# EAGLE design lokalizator_płytka_uniwersalna (EAGLE 8.5.2)
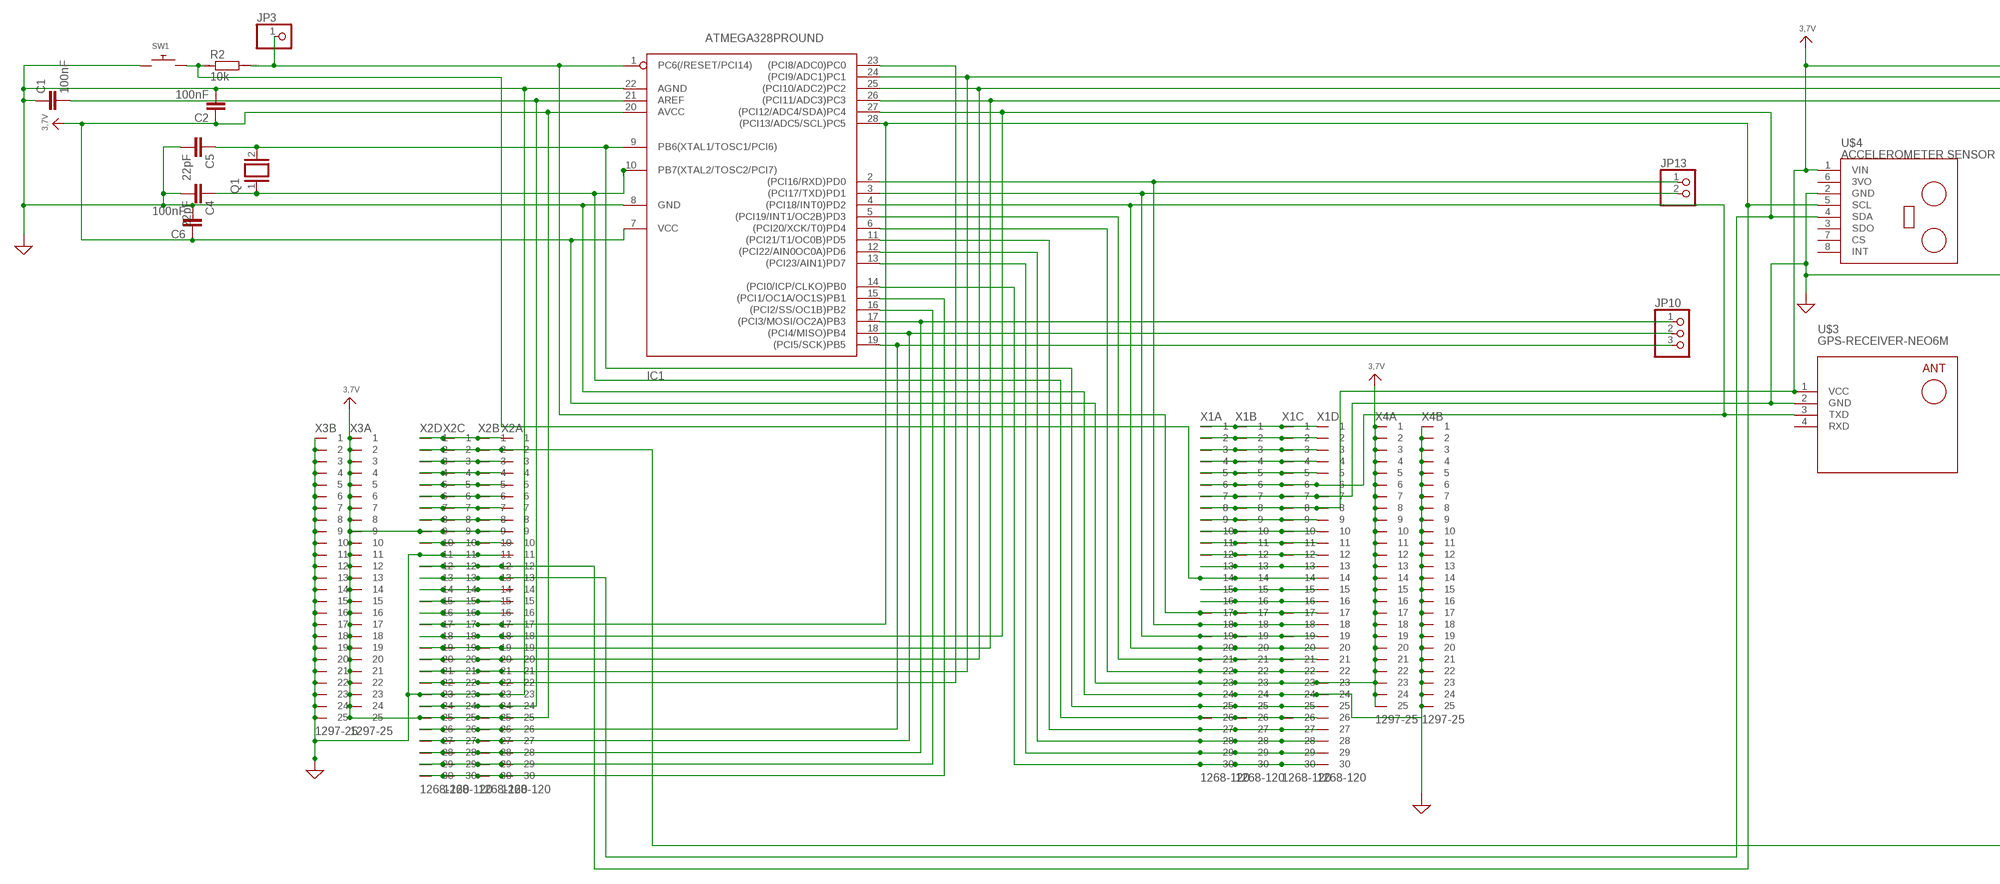
[diagram p0: schematic, sheet 1, part 1 of 2]
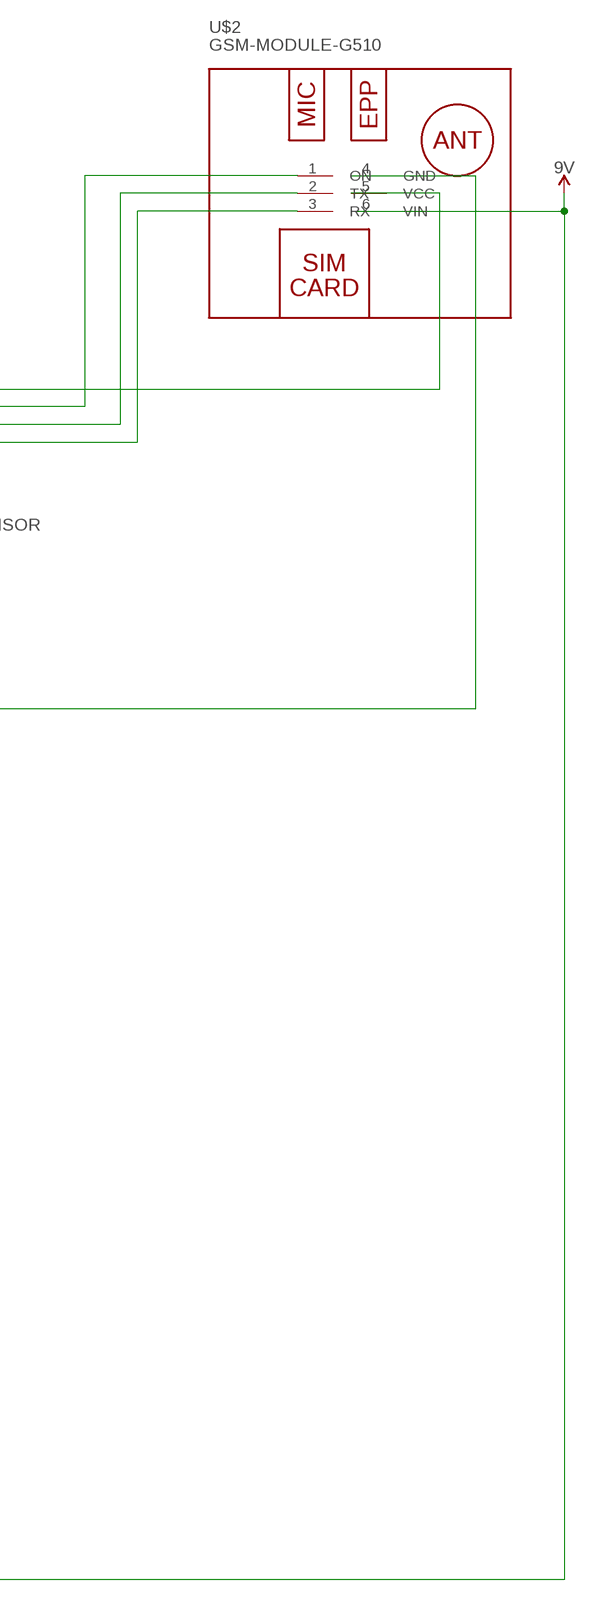
[diagram p1: schematic, sheet 1, part 2 of 2]

## Parts
C1  100nF  C2,5-3  [C2.5-3]
C2  100nF  C2,5-3  [C2.5-3]
C4  22pF  C2,5-3  [C2.5-3]
C5  22pF  C2,5-3  [C2.5-3]
C6  100nF  C2,5-3  [C2.5-3]
IC1  ATMEGA328PROUND  [DIL28-3-ROUND]
JP3  PINHD-1X1  [1X01]
JP10  PINHD-1X3  [1X03]
JP13  PINHD-1X2  [1X02]
Q1  XTAL  [Q]
R2  10k  R0204/7  [0204/7]
SW1  SWITCH_PUSHBUTTONEVQ-PE  [TACT_PANA-EVQ]
U$2  GSM-MODULE-G510  GSM-MODEM-SIM900A  [GSM-MODEM-SIM900A]
U$3  GPS-RECEIVER-NEO6M  [GPS-RECEIVER-NEO6M]
U$4  ACCELEROMETER SENSOR  LIGHT-SENSOR-BH1750  [LIGHT-SENSOR-BH1750]
X1  1268-120  [1268-120]
X2  1268-120  [1268-120]
X3  1297-25  [1297-25]
X4  1297-25  [1297-25]

## Nets
GND: C1.1 C2.2 C4.2 C5.2 C6.2 IC1.8(GND) IC1.22(AGND) SW1.P$1 U$2.4(GND) U$3.2(GND) U$4.2(GND) X1.A7 X1.A24 X1.B7 X1.B24 X1.C7 X1.C24 X1.D7 X1.D24 X2.A11 X2.A23 X2.B11 X2.B23 X2.C11 X2.C23 X2.D11 X2.D23 X3.B1 X3.B2 X3.B3 X3.B4 X3.B5 X3.B6 X3.B7 X3.B8 X3.B9 X3.B10 X3.B11 X3.B12 X3.B13 X3.B14 X3.B15 X3.B16 X3.B17 X3.B18 X3.B19 X3.B20 X3.B21 X3.B22 X3.B23 X3.B24 X3.B25 X4.B1 X4.B2 X4.B3 X4.B4 X4.B5 X4.B6 X4.B7 X4.B8 X4.B9 X4.B10 X4.B11 X4.B12 X4.B13 X4.B14 X4.B15 X4.B16 X4.B17 X4.B18 X4.B19 X4.B20 X4.B21 X4.B22 X4.B23 X4.B24 X4.B25 ; supply symbol labelled SUP
N$1: R2.1 SW1.P$2 X1.A14 X1.B14 X1.C14 X1.D14
N$2: IC1.1(PC6(/RESET/PCI14)) JP3.1 R2.2 X1.A17 X1.B17 X1.C17 X1.D17
N$3: C1.2 IC1.21(AREF) X2.A24 X2.B24 X2.C24 X2.D24
N$5: IC1.19((PCI5/SCK)PB5) JP10.3 X2.A26 X2.B26 X2.C26 X2.D26
N$6: C5.1 IC1.9(PB6(XTAL1/TOSC1/PCI6)) Q1.2 X1.A25 X1.B25 X1.C25 X1.D25
N$7: C4.1 IC1.10(PB7(XTAL2/TOSC2/PCI7)) Q1.1 X1.A26 X1.B26 X1.C26 X1.D26
N$8: IC1.18((PCI4/MISO)PB4) JP10.2 X2.A27 X2.B27 X2.C27 X2.D27
N$9: IC1.17((PCI3/MOSI/OC2A)PB3) JP10.1 X2.A28 X2.B28 X2.C28 X2.D28
N$10: IC1.14((PCI0/ICP/CLKO)PB0) X1.A30 X1.B30 X1.C30 X1.D30
N$11: IC1.28((PCI13/ADC5/SCL)PC5) U$4.5(SCL) X2.A12 X2.A17 X2.B12 X2.B17 X2.C12 X2.C17 X2.D12 X2.D17
N$12: X1.A16 X1.B16 X1.C16 X1.D16
N$13: IC1.4((PCI18/INT0)PD2) U$3.3(TXD) X1.A6 X1.A20 X1.B6 X1.B20 X1.C6 X1.C20 X1.D6 X1.D20
N$14: IC1.24((PCI9/ADC1)PC1) U$2.1(ON) X2.A21 X2.B21 X2.C21 X2.D21
N$15: IC1.2((PCI16/RXD)PD0) JP13.1 X1.A18 X1.B18 X1.C18 X1.D18
N$16: IC1.3((PCI17/TXD)PD1) JP13.2 X1.A19 X1.B19 X1.C19 X1.D19
N$17: IC1.25((PCI10/ADC2)PC2) U$2.2(TX) X2.A20 X2.B20 X2.C20 X2.D20
N$18: IC1.26((PCI11/ADC3)PC3) U$2.3(RX) X2.A19 X2.B19 X2.C19 X2.D19
N$19: IC1.15((PCI1/OC1A/OC1S)PB1) X2.A30 X2.B30 X2.C30 X2.D30
N$20: IC1.16((PCI2/SS/OC1B)PB2) X2.A29 X2.B29 X2.C29 X2.D29
N$21: IC1.13((PCI23/AIN1)PD7) X1.A29 X1.B29 X1.C29 X1.D29
N$22: IC1.12((PCI22/AIN0OC0A)PD6) X1.A28 X1.B28 X1.C28 X1.D28
N$23: IC1.11((PCI21/T1/OC0B)PD5) X1.A27 X1.B27 X1.C27 X1.D27
N$24: IC1.23((PCI8/ADC0)PC0) X2.A22 X2.B22 X2.C22 X2.D22
N$25: IC1.5((PCI19/INT1/OC2B)PD3) X1.A21 X1.B21 X1.C21 X1.D21
N$26: IC1.27((PCI12/ADC4/SDA)PC4) U$4.4(SDA) X2.A13 X2.A18 X2.B13 X2.B18 X2.C13 X2.C18 X2.D13 X2.D18
N$27: IC1.6((PCI20/XCK/T0)PD4) X1.A22 X1.B22 X1.C22 X1.D22
N$28: X1.A15 X1.B15 X1.C15 X1.D15
N$29: X1.A13 X1.B13 X1.C13 X1.D13
N$30: X1.A12 X1.B12 X1.C12 X1.D12
N$31: X1.A11 X1.B11 X1.C11 X1.D11
N$32: X1.A10 X1.B10 X1.C10 X1.D10
N$33: X1.A9 X1.B9 X1.C9 X1.D9
N$37: X1.A5 X1.B5 X1.C5 X1.D5
N$38: X1.A4 X1.B4 X1.C4 X1.D4
N$39: X1.A3 X1.B3 X1.C3 X1.D3
N$40: X1.A2 X1.B2 X1.C2 X1.D2
N$41: X1.A1 X1.B1 X1.C1 X1.D1
N$42: X2.A16 X2.B16 X2.C16 X2.D16
N$43: X2.A15 X2.B15 X2.C15 X2.D15
N$44: X2.A14 X2.B14 X2.C14 X2.D14
N$48: X2.A10 X2.B10 X2.C10 X2.D10
N$50: X2.A8 X2.B8 X2.C8 X2.D8
N$51: X2.A7 X2.B7 X2.C7 X2.D7
N$52: X2.A6 X2.B6 X2.C6 X2.D6
N$53: X2.A5 X2.B5 X2.C5 X2.D5
N$54: X2.A4 X2.B4 X2.C4 X2.D4
N$55: X2.A3 X2.B3 X2.C3 X2.D3
N$57: X2.A1 X2.B1 X2.C1 X2.D1
VCC: C2.1 C6.1 IC1.7(VCC) IC1.20(AVCC) U$2.5(VCC) U$2.6(VIN) U$3.1(VCC) U$4.1(VIN) X1.A8 X1.A23 X1.B8 X1.B23 X1.C8 X1.C23 X1.D8 X1.D23 X2.A2 X2.A9 X2.A25 X2.B2 X2.B9 X2.B25 X2.C2 X2.C9 X2.C25 X2.D2 X2.D9 X2.D25 X3.A1 X3.A2 X3.A3 X3.A4 X3.A5 X3.A6 X3.A7 X3.A8 X3.A9 X3.A10 X3.A11 X3.A12 X3.A13 X3.A14 X3.A15 X3.A16 X3.A17 X3.A18 X3.A19 X3.A20 X3.A21 X3.A22 X3.A23 X3.A24 X3.A25 X4.A1 X4.A2 X4.A3 X4.A4 X4.A5 X4.A6 X4.A7 X4.A8 X4.A9 X4.A10 X4.A11 X4.A12 X4.A13 X4.A14 X4.A15 X4.A16 X4.A17 X4.A18 X4.A19 X4.A20 X4.A21 X4.A22 X4.A23 X4.A24 X4.A25 ; supply symbol labelled 3,7V, 9V
Unconnected: U$4.3(SDO) U$4.7(CS) U$4.8(INT)

## Power pins joined to a net without a drawn wire
3VO: U$4.6(3VO)
RXD: U$3.4(RXD)

## Library data of the parts
C1 C2 C4-C6 = capacitor-wima:C: CAPACITOR naming: grid - package width
IC1 = atmega328:ATMEGA328*P: MICROCONTROLLER 32 kBytes FLASH 2 kBytes SRAM 1 kBytes EEPROM USART 8-channel 10 bit ADC
JP3 = adafruit:PINHD-1X1: Pin header 1x1 for 0.1" spacing With round pins
JP10 = adafruit:PINHD-1X3: PIN HEADER
JP13 = pinhead:PINHD-1X2: PIN HEADER
Q1 = special:XTAL: CRYSTAL
R2 = eagle-ltspice:R: RESISTOR, European symbol; SPICEMODEL: NONE; SPICEPREFIX: R
SW1 = adafruit:SWITCH_PUSHBUTTON: Buttons SOFTTOUCHSMD_SJ - Soft touch temporary push button (Super Junk Akihabara) Compatible with SKPMANE010 [Mouser: 688-SKPMAN] C&K_KSS = Digikey: KSS221GLFS
U$2 = diy-modules2:GSM-MODEM-SIM900A: GSM Mini Module based on SIM900A Schematic available here: http://www.electrodragon.com/w/SIM900_(SIM900A)_Mini_DEV_Board
U$3 = diy-modules2:GPS-RECEIVER-NEO6M: GPS Receiver Module based on NEO-6 device Short tutorial how to use NEO-6 module with Arduino: http://www.xarg.org/2016/06/neo6mv2-gps-module-with-arduino/ NEO-6 datasheet is available here: https://www.u-blox.com/sites/default/files/products/documents/NEO-6_DataSheet_%28GPS.G6-HW-09005%29.pdf Click here to find device on ebay.com <http://www.ebay.com/sch/gyneo6mv2>
U$4 = diy-modules2:LIGHT-SENSOR-BH1750: Digital Light Sensor based on BH1750
X1 X2 = con-commcon:1268-120: .800" BOARD SPACE 2mm CONNECTORS - HI TEMP FOUR ROW 2mm - STACKTHROUGH & NON-STACKTHROUGH; OC_FARNELL: unknown; OC_NEWARK: unknown
X3 X4 = con-commcon:1297-25: .800" BOARD SPACE 2mm CONNECTORS - HI TEMP TWO ROW 2mm - NON-STACKTHROUGH; OC_FARNELL: unknown; OC_NEWARK: unknown

## Module 123
Ports: 

### Library data of the parts

## Board
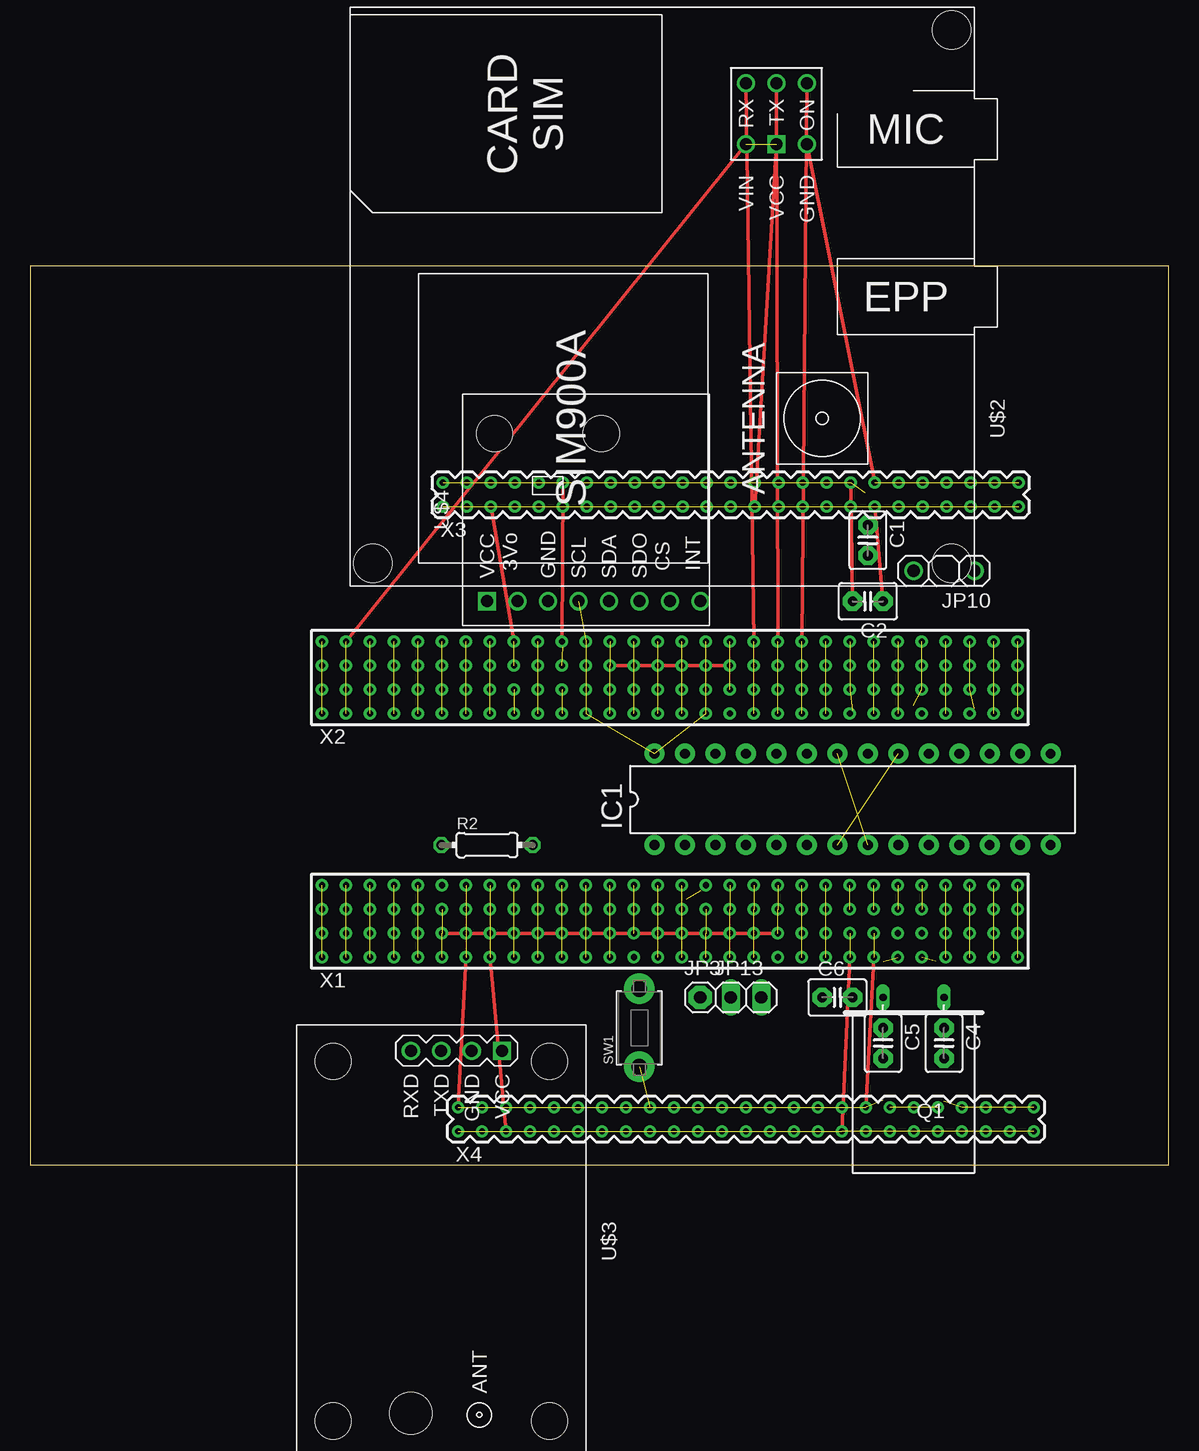
[diagram p2: board, top side]
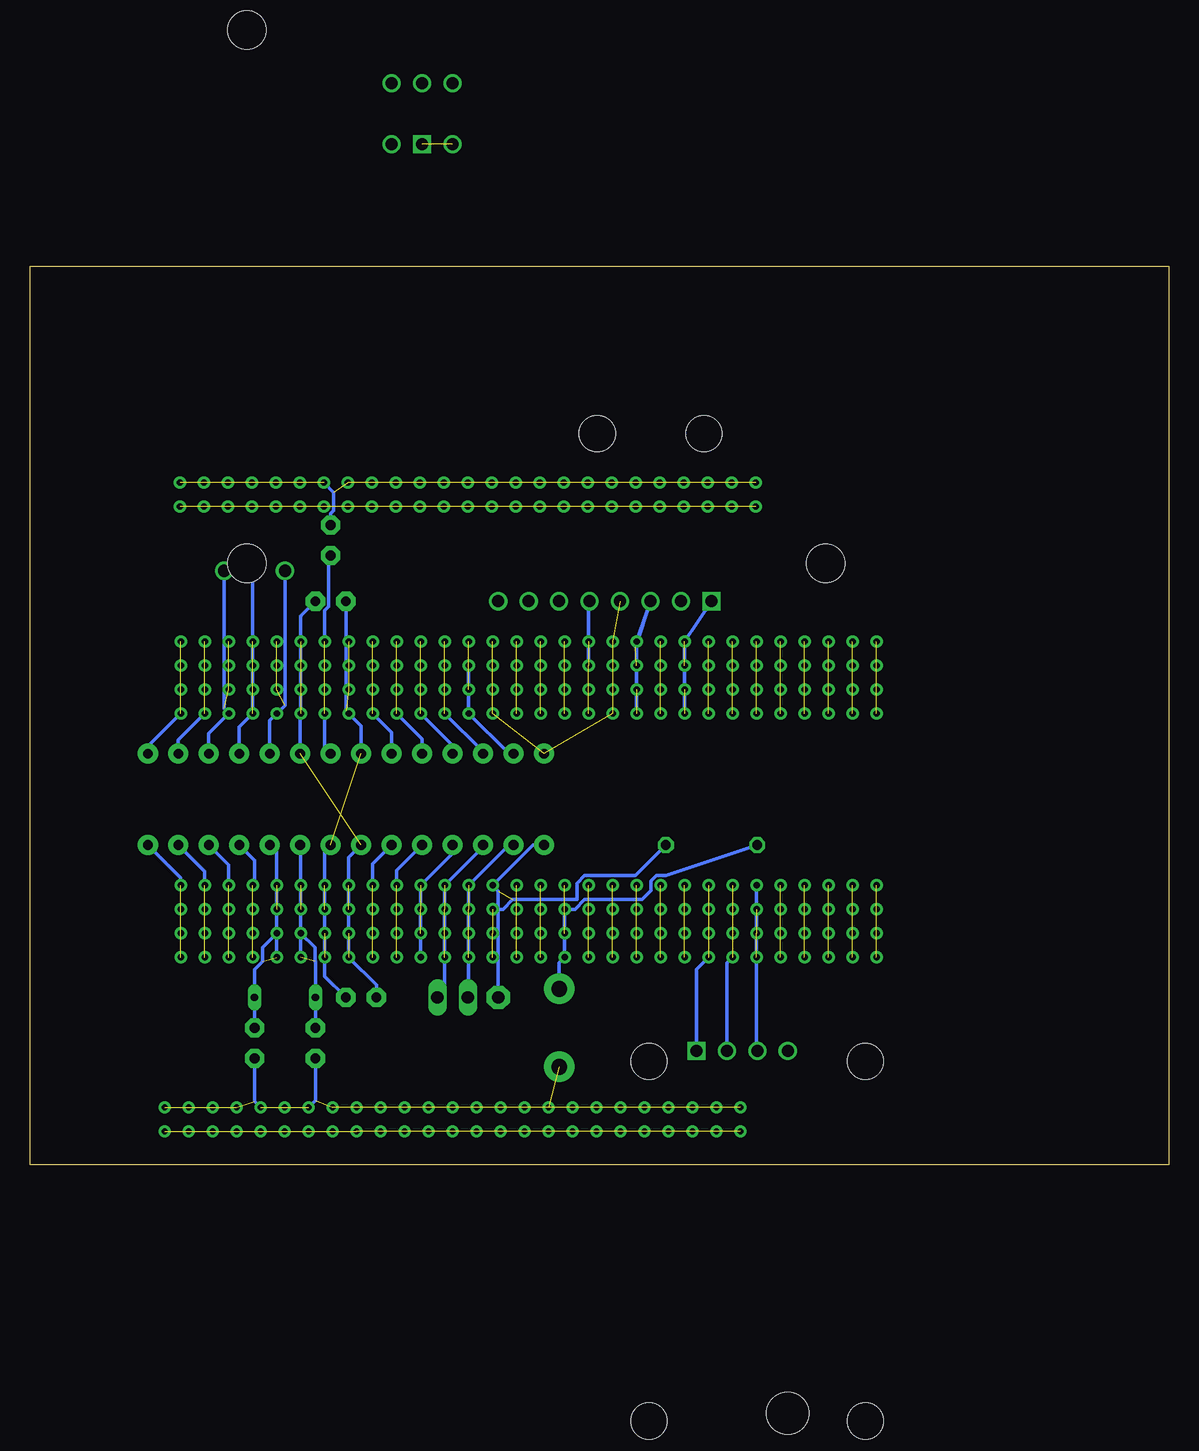
[diagram p3: board, bottom side, seen from below]

Size 94.92 x 74.92 mm. Coordinates in mm from the lower left corner, seen from the top.
Outline: 0,0 94.92,0 94.92,74.92 0,74.92 0,0
Copper layers (1*16): Top 0.035mm / dielectric 1.5mm / Bottom 0.035mm
Design rules "default": minimum track width 6mil, minimum drill 0.35mm, track to track 6mil, track to pad 6mil, pad to pad 6mil, via to via 6mil, smd to smd 6mil, copper to edge 40mil, drill to drill 6mil, minimum pad ring 10mil, minimum via ring 8mil, stop-mask expansion 4mil, vias tented up to drill 0mil, thermal gap 10mil

### Footprints (pad centres in the part's own frame; a part is rotated, then mirrored left to right if it is on the bottom)
C2.5-3 = drill 0.813 pad 1.6 octagon: 1 -1.27,0; 2 1.27,0
DIL28-3-ROUND = drill 0.813 pad 1.676: 1 -16.51,-3.81; 2 -13.97,-3.81; 3 -11.43,-3.81; 4 -8.89,-3.81; 5 -6.35,-3.81; 6 -3.81,-3.81; 7 -1.27,-3.81; 8 1.27,-3.81; 9 3.81,-3.81; 10 6.35,-3.81; 11 8.89,-3.81; 12 11.43,-3.81; 13 13.97,-3.81; 14 16.51,-3.81; 15 16.51,3.81; 16 13.97,3.81; 17 11.43,3.81; 18 8.89,3.81; 19 6.35,3.81; 20 3.81,3.81; 21 1.27,3.81; 22 -1.27,3.81; 23 -3.81,3.81; 24 -6.35,3.81; 25 -8.89,3.81; 26 -11.43,3.81; 27 -13.97,3.81; 28 -16.51,3.81
1X01 = drill 1.016 pad 1.93 octagon: 1 0,0
1X03 = drill 1.016: 1 -2.54,0; 2 0,0; 3 2.54,0
1X02 = drill 1.016 long: 1 -1.27,0; 2 1.27,0
Q = drill 0.61 long: 1 -2.54,-7.62; 2 2.54,-7.62
0204/7 = drill 0.813 octagon: 1 -3.81,0; 2 3.81,0
TACT_PANA-EVQ = drill 1.3 pad 2.54: P$1 -3.25,0; P$2 3.25,0
GSM-MODEM-SIM900A = drill 1: 1 -17.78,12.7; 2 -17.78,10.16; 3 -17.78,7.62; 4 -12.7,12.7; 6 -12.7,7.62 | drill 1 square: 5 -12.7,10.16 | hole 3.2: -22.225,24.765; 22.225,24.765; 22.225,-23.495
GPS-RECEIVER-NEO6M = drill 1 square: 1 -15.875,5.08 | drill 1: 2 -15.875,2.54; 3 -15.875,0; 4 -15.875,-2.54 | hole 3: -14.986,9.017; -14.986,-9.017; 14.986,-9.017; 14.986,9.017 | hole 3.5: 14.351,-2.54
LIGHT-SENSOR-BH1750 = drill 1 square: 1 -7.62,5.08 | drill 1: 2 -7.62,0; 3 -7.62,-7.62; 4 -7.62,-5.08; 5 -7.62,-2.54; 6 -7.62,2.54; 7 -7.62,-10.16; 8 -7.62,-12.7 | hole 3: 6.35,4.445; 6.35,-4.445
1268-120 = drill 0.508: A1 -29,-3; A2 -27,-3; A3 -25,-3; A4 -23,-3; A5 -21,-3; A6 -19,-3; A7 -17,-3; A8 -15,-3; A9 -13,-3; A10 -11,-3; A11 -9,-3; A12 -7,-3; A13 -5,-3; A14 -3,-3; A15 -1,-3; A16 1,-3; A17 3,-3; A18 5,-3; A19 7,-3; A20 9,-3; A21 11,-3; A22 13,-3; A23 15,-3; A24 17,-3; A25 19,-3; A26 21,-3; A27 23,-3; A28 25,-3; A29 27,-3; A30 29,-3; B1 -29,-1; B2 -27,-1; B3 -25,-1; B4 -23,-1; B5 -21,-1; B6 -19,-1; B7 -17,-1; B8 -15,-1; B9 -13,-1; B10 -11,-1; B11 -9,-1; B12 -7,-1; B13 -5,-1; B14 -3,-1; B15 -1,-1; B16 1,-1; B17 3,-1; B18 5,-1; B19 7,-1; B20 9,-1; B21 11,-1; B22 13,-1; B23 15,-1; B24 17,-1; B25 19,-1; B26 21,-1; B27 23,-1; B28 25,-1; B29 27,-1; B30 29,-1; C1 -29,1; C2 -27,1; C3 -25,1; C4 -23,1; C5 -21,1; C6 -19,1; C7 -17,1; C8 -15,1; C9 -13,1; C10 -11,1; C11 -9,1; C12 -7,1; C13 -5,1; C14 -3,1; C15 -1,1; C16 1,1; C17 3,1; C18 5,1; C19 7,1; C20 9,1; C21 11,1; C22 13,1; C23 15,1; C24 17,1; C25 19,1; C26 21,1; C27 23,1; C28 25,1; C29 27,1; C30 29,1; D1 -29,3; D2 -27,3; D3 -25,3; D4 -23,3; D5 -21,3; D6 -19,3; D7 -17,3; D8 -15,3; D9 -13,3; D10 -11,3; D11 -9,3; D12 -7,3; D13 -5,3; D14 -3,3; D15 -1,3; D16 1,3; D17 3,3; D18 5,3; D19 7,3; D20 9,3; D21 11,3; D22 13,3; D23 15,3; D24 17,3; D25 19,3; D26 21,3; D27 23,3; D28 25,3; D29 27,3; D30 29,3
1297-25 = drill 0.508: A1 -24,-1; A2 -22,-1; A3 -20,-1; A4 -18,-1; A5 -16,-1; A6 -14,-1; A7 -12,-1; A8 -10,-1; A9 -8,-1; A10 -6,-1; A11 -4,-1; A12 -2,-1; A13 0,-1; A14 2,-1; A15 4,-1; A16 6,-1; A17 8,-1; A18 10,-1; A19 12,-1; A20 14,-1; A21 16,-1; A22 18,-1; A23 20,-1; A24 22,-1; A25 24,-1; B1 -24,1; B2 -22,1; B3 -20,1; B4 -18,1; B5 -16,1; B6 -14,1; B7 -12,1; B8 -10,1; B9 -8,1; B10 -6,1; B11 -4,1; B12 -2,1; B13 0,1; B14 2,1; B15 4,1; B16 6,1; B17 8,1; B18 10,1; B19 12,1; B20 14,1; B21 16,1; B22 18,1; B23 20,1; B24 22,1; B25 24,1

### Placement (x,y rotation side)
C1  69.85,52.07 270 top
C2  69.85,46.99 180 top
C4  76.2,10.16 270 top
C5  71.12,10.16 270 top
C6  67.31,13.97 0 top
IC1  68.58,30.48 0 top
JP3  55.88,13.97 0 top
JP10  76.2,49.53 180 top
JP13  59.69,13.97 0 top
Q1  73.66,6.35 180 top
R2  38.1,26.67 0 top
SW1  50.8,11.43 90 top
U$2  52.07,72.39 270 top
U$3  34.29,-6.35 270 top
U$4  43.18,54.61 90 top
X1  53.34,20.32 0 top
X2  53.34,40.64 0 top
X3  58.42,55.88 0 top
X4  59.69,3.81 0 top

### Tracks (layer width: path | path; a pad name or v marks a point on that pad's centre or on a via)
GND  (60 unrouted)
  Top 0.305: X1.A7 X4.B1 | X1.A24 X4.B18 | C2.2 X3.B18 | X2.D11 X3.B6 | U$2.4 X3.B19
  Bottom 0.305: IC1.8 70.34,26.18 X1.D24 X1.A24 70.34,15.73 C6.2 | IC1.22 67.31,36.61 X2.A23 68.58,37.88 C2.2 | 44.45,43.18 U$4.2 X2.D11 X2.A11 | U$3.2 36.83,16.83 X1.A7 | C5.2 71.12,5.38 X4.B19 | C4.2 76.2,5.32 X4.B21 | C1.1 69.85,54.3 69.61,54.54 69.61,56.07 X3.B19
N$1  (2 unrouted)
  Bottom 0.305: R2.1 41.91,24.13 42.68,24.13 43.15,23.66 43.15,22.89 43.91,22.13 48.68,22.13 49.49,21.32 X1.C14 X1.A14 50.8,16.86 SW1.P$2
N$2  (3 unrouted)
  Bottom 0.305: IC1.1 52.99,26.67 X1.D17 55.88,22.86 JP3.1 | R2.2 44.45,24.13 48.68,24.13 49.32,23.49 49.32,22.13 54.68,22.13 55.49,21.32 X1.C17
N$3  (3 unrouted)
  Bottom 0.305: X2.A24 70.34,34.78 IC1.21 | X2.D24 70.34,46.21 70.02,46.53 70.02,50.64 C1.2
N$5  (3 unrouted)
  Bottom 0.305: IC1.19 74.93,37.05 X2.A26 73.66,38.32 JP10.3
N$6  (2 unrouted)
  Bottom 0.305: IC1.9 72.34,26.62 X1.D25 X1.A25 | X1.B25 71.15,18.13 71.15,16.98 71.12,16.95 Q1.2 C5.1
N$7  (2 unrouted)
  Bottom 0.305: IC1.10 74.34,26.08 X1.D26 X1.A26 | X1.B26 75.53,18.13 75.53,16.98 76.2,16.31 Q1.1 C4.1
N$8  (3 unrouted)
  Bottom 0.305: IC1.18 77.47,36.51 X2.A27 76.34,49.39 JP10.2
N$9  (3 unrouted)
  Bottom 0.305: IC1.17 80.01,35.97 X2.A28 78.74,38.04 JP10.1
N$10  (3 unrouted)
  Bottom 0.305: IC1.14 82.34,23.92 X1.D30
N$11  (9 unrouted)
N$12  (3 unrouted)
N$13  (4 unrouted)
  Top 0.305: X1.B6 X1.B20
  Bottom 0.305: 34.29,17.27 X1.A6 | X1.A6 X1.D6 | U$3.3 34.34,9.57 X1.A6 | X1.A20 X1.D20 59.69,25.97 IC1.4
N$14  (3 unrouted)
  Top 0.305: U$2.1 X2.D21
  Bottom 0.305: X2.A21 62.23,35.53 IC1.24
N$15  (3 unrouted)
  Bottom 0.305: IC1.2 54.99,26.67 X1.D18 58.34,14.05 JP13.1
N$16  (3 unrouted)
  Bottom 0.305: IC1.3 57.15,26.51 X1.D19 60.34,14.59 JP13.2
N$17  (3 unrouted)
  Top 0.305: U$2.2 X2.D20
  Bottom 0.305: X2.A20 59.69,34.99 IC1.25
N$18  (3 unrouted)
  Top 0.305: U$2.3 X2.D19
  Bottom 0.305: X2.A19 57.15,34.45 IC1.26
N$19  (3 unrouted)
  Bottom 0.305: X2.A30 85.09,34.89 IC1.15
N$20  (3 unrouted)
  Bottom 0.305: X2.A29 82.55,35.43 IC1.16
N$21  (3 unrouted)
  Bottom 0.305: IC1.13 80.34,24.46 X1.D29
N$22  (3 unrouted)
  Bottom 0.305: IC1.12 78.34,25 X1.D28
N$23  (3 unrouted)
  Bottom 0.305: IC1.11 76.2,25.4 76.2,23.46 X1.D27
N$24  (3 unrouted)
  Bottom 0.305: X2.A22 64.77,36.07 IC1.23
N$25  (3 unrouted)
  Bottom 0.305: X1.D21 64.34,24.56 IC1.5
N$26  (5 unrouted)
  Top 0.305: X2.C13 X2.C18
  Bottom 0.305: U$4.4 48.34,46.91 X2.C13 | IC1.27 54.99,34.29 X2.A18 X2.C18
N$27  (3 unrouted)
  Bottom 0.305: X1.D22 66.34,25.1 IC1.6
N$28  (3 unrouted)
N$29  (3 unrouted)
N$30  (3 unrouted)
N$31  (3 unrouted)
N$32  (3 unrouted)
N$33  (3 unrouted)
N$37  (3 unrouted)
N$38  (3 unrouted)
N$39  (3 unrouted)
N$40  (3 unrouted)
N$41  (3 unrouted)
N$42  (3 unrouted)
N$43  (3 unrouted)
N$44  (3 unrouted)
N$48  (3 unrouted)
N$50  (3 unrouted)
N$51  (3 unrouted)
N$52  (3 unrouted)
N$53  (3 unrouted)
N$54  (3 unrouted)
N$55  (3 unrouted)
N$57  (3 unrouted)
VCC  (63 unrouted)
  Top 0.305: U$2.6 X2.D2 | X1.A8 X4.A3 | X1.A23 X4.A17 | C2.1 X3.A19 | X2.D9 X3.A3 | U$2.5 X3.A14
  Bottom 0.305: IC1.7 68.34,25.64 X1.D23 X1.A23 66.04,15.02 C6.1 | IC1.20 72.39,37.59 X2.A25 72.34,45.77 C2.1 | U$3.1 39.37,16.29 X1.A8 | U$4.1 X2.D9 X2.A9